# Altium schematic sheet revisions-planned.SchDoc
size A4; SheetNumber: 12; SheetTotal: 12
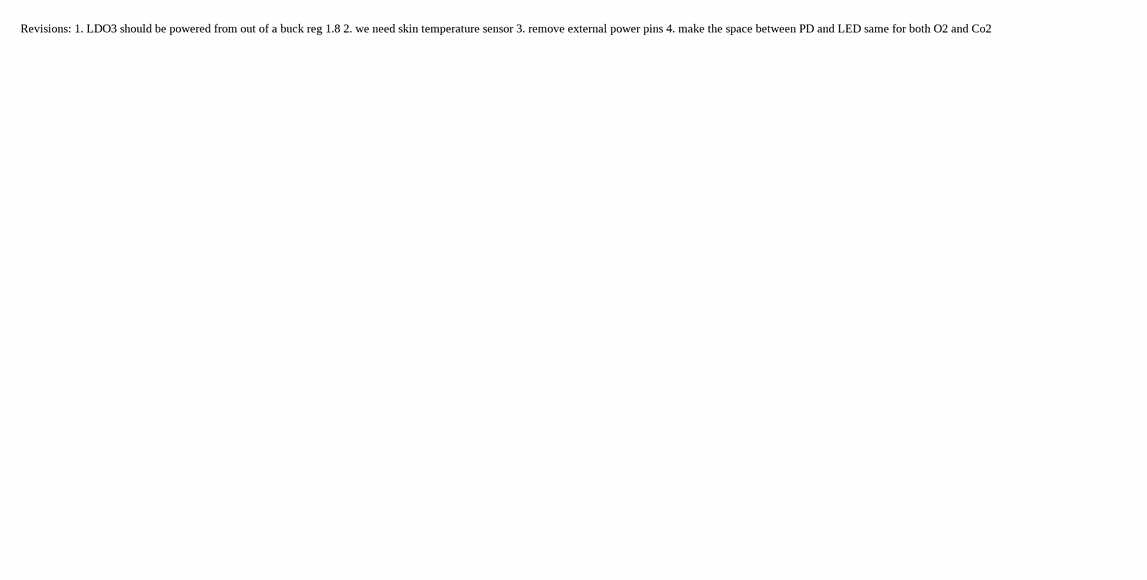
[diagram p0: revisions-planned.SchDoc]

## Notes on the sheet
- Revisions: 1. LDO3 should be powered from out of a buck reg 1.8 2. we need skin temperature sensor 3. remove external power pins 4. make the space between PD and LED same for both O2 and Co2